# Altium project 2040Macro.PrjPcb
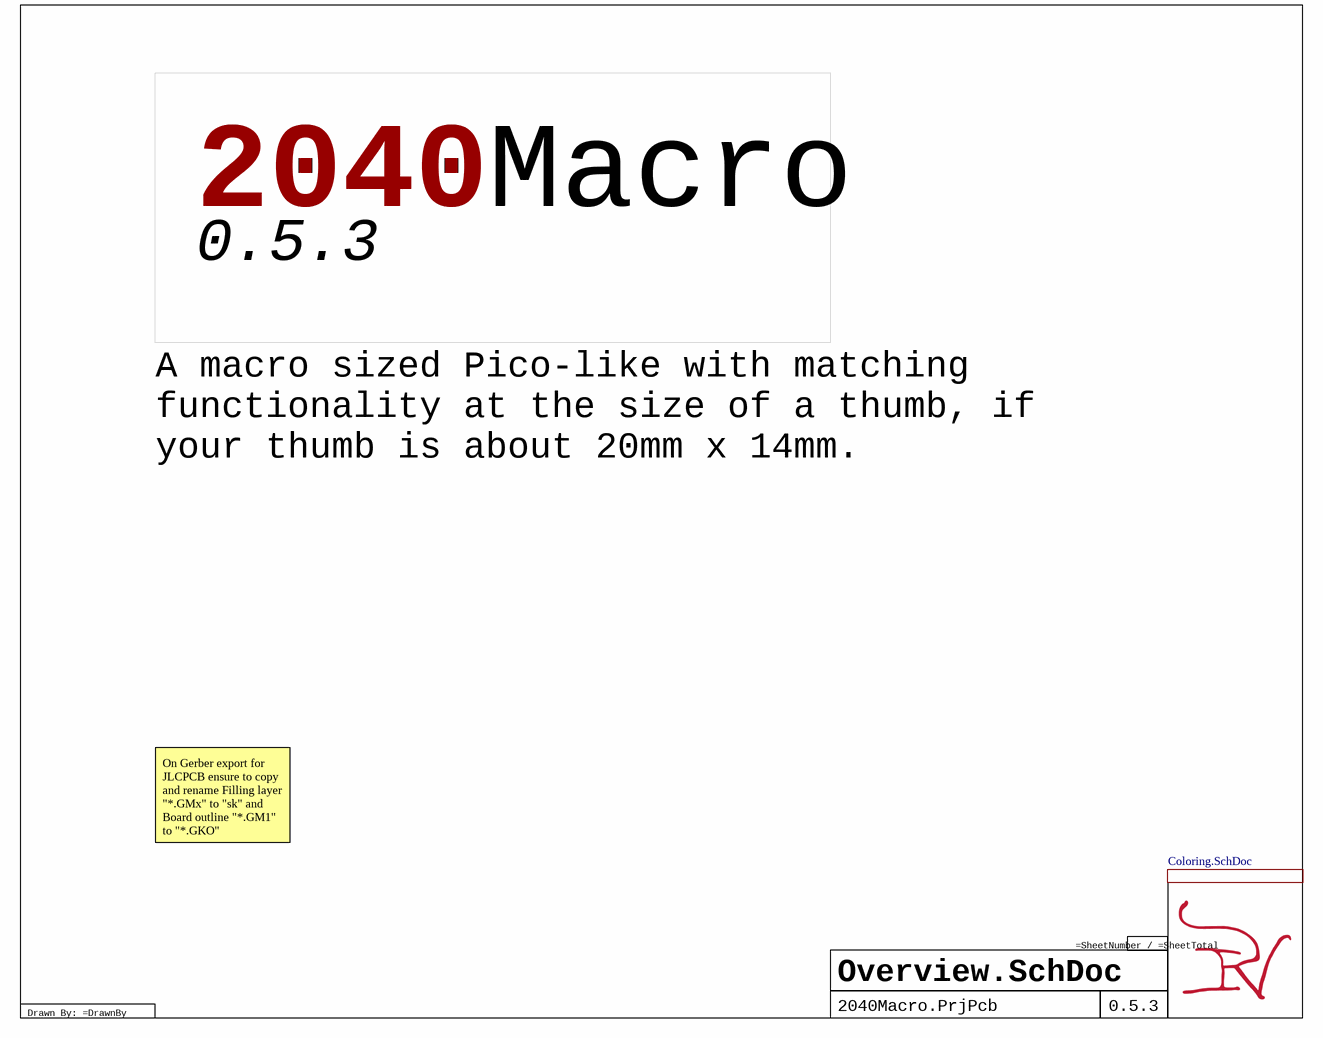
[diagram p0: Overview.SchDoc]
Version: 0.5.3; Project: 2040Macro; LicenceYear: Copyright © 2024; Licence: Licenced under CERN-OHL-P v2; DrawnBy: IR; Author: IR
10 sheets, 56 parts. Net scope: flat (ports and power ports of the same name join across sheets).
Board file: 2040Macro.PcbDoc
Sheets:
  Overview.SchDoc
    LINK_ME_AND_HIDE_DESIGNATOR = 2040Macro-PCB.SchDoc
      U_RP2040 = RP2040.SchDoc
      U_Power = Power.SchDoc
      U_LED = LED.SchDoc
      U_Crystal = Crystal.SchDoc
      U_SPIFlash = SPIFlash.SchDoc
      U_Connectors = Connectors.SchDoc
        U_USBC-DEV-2.0 = USBC-DEV-2.0.SchDoc
    U_Coloring = Coloring.SchDoc

## Sheet Overview.SchDoc: PMPi-PCB
size A; SheetNumber: 1; SheetTotal: 10

### Sub-sheets
LINK_ME_AND_HIDE_DESIGNATOR = 2040Macro-PCB.SchDoc: no entries
U_Coloring = Coloring.SchDoc: no entries

### Notes on the sheet
- 2040
- A macro sized Pico-like with matching functionality at the size of a thumb, if your thumb is about 20mm x 14mm.
- On Gerber export for JLCPCB ensure to copy and rename Filling layer "*.GMx" to "sk" and Board outline "*.GM1" to "*.GKO"
- Drawn By: =DrawnBy

## Sheet 2040Macro-PCB.SchDoc
size A; SheetNumber: 3; SheetTotal: 9
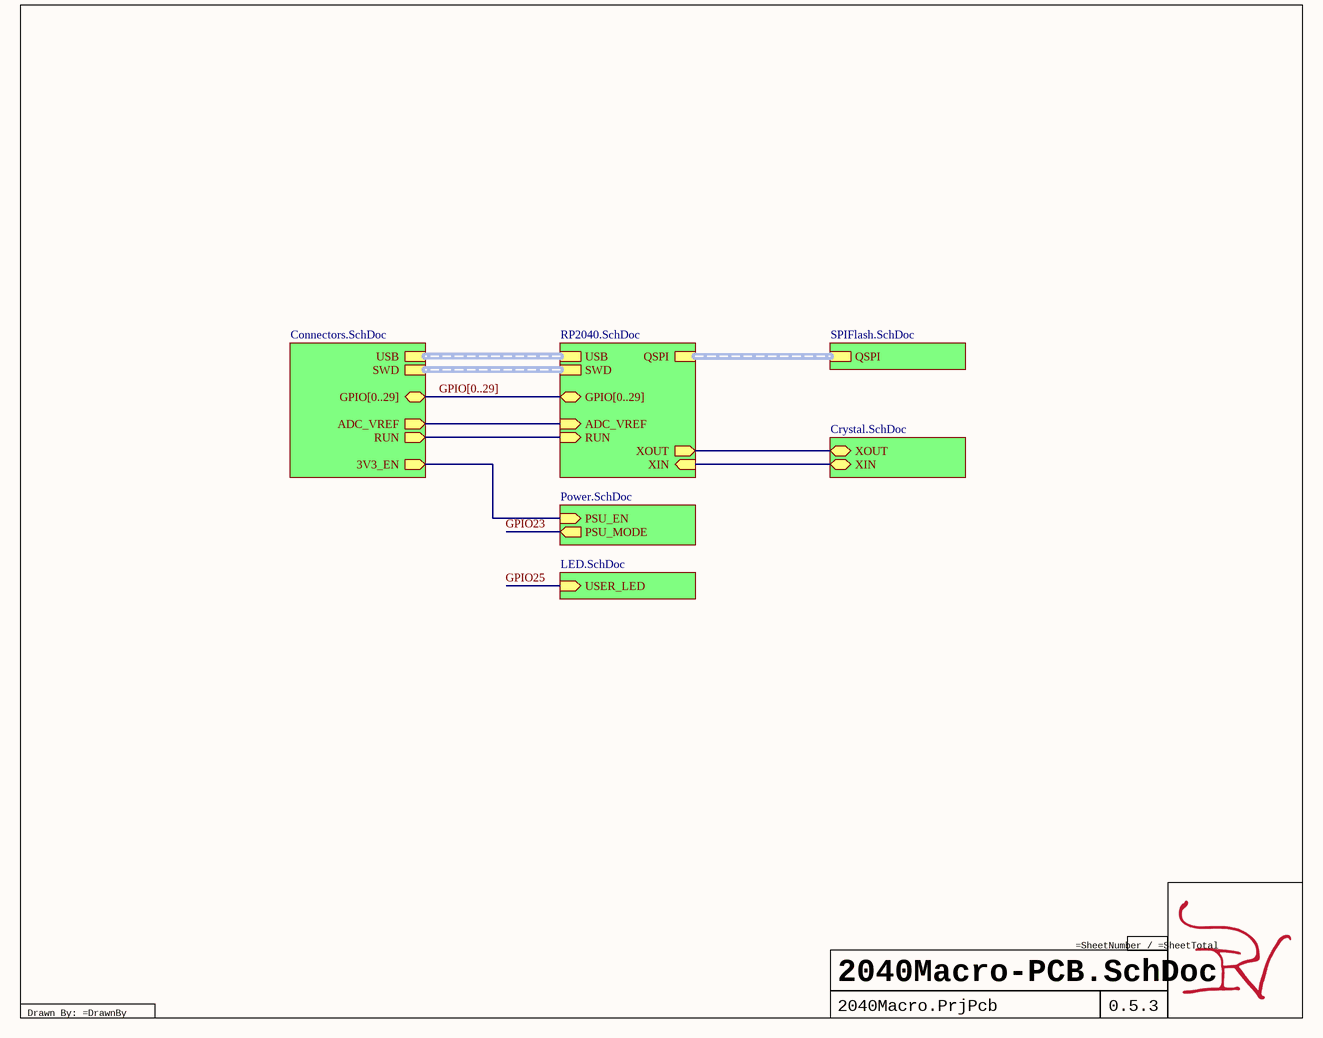
[diagram p1: 2040Macro-PCB.SchDoc]

### Sub-sheets
U_Connectors = Connectors.SchDoc: SWD (harness SWD), USB (harness USB 2.0), GPIO[0..29] (bidir), 3V3_EN (out), ADC_VREF (out), RUN (out)
U_Crystal = Crystal.SchDoc: XIN (bidir), XOUT (bidir)
U_LED = LED.SchDoc: USER_LED (in)
U_Power = Power.SchDoc: PSU_EN (in), PSU_MODE (out)
U_RP2040 = RP2040.SchDoc: GPIO[0..29] (bidir), USB (harness USB 2.0), XIN (in), XOUT (out), SWD (harness SWD), QSPI (harness QSPI), ADC_VREF (in), RUN (in)
U_SPIFlash = SPIFlash.SchDoc: QSPI (harness QSPI)

### Nets
GPIO23: sheet U_Power/PSU_MODE
GPIO25: sheet U_LED/USER_LED
(unnamed): sheet U_RP2040/XIN, sheet U_Crystal/XIN
(unnamed): sheet U_RP2040/XOUT, sheet U_Crystal/XOUT
(unnamed): sheet U_RP2040/ADC_VREF, sheet U_Connectors/ADC_VREF
(unnamed): sheet U_RP2040/RUN, sheet U_Connectors/RUN
(unnamed): sheet U_Power/PSU_EN, sheet U_Connectors/3V3_EN

### Buses and harness runs
bus GPIO[0..29] = sheet U_Connectors/GPIO[0..29] = sheet U_RP2040/GPIO[0..29]
harness sheet U_Connectors/SWD = sheet U_RP2040/SWD
harness sheet U_Connectors/USB = sheet U_RP2040/USB
harness sheet U_RP2040/QSPI = sheet U_SPIFlash/QSPI

### Notes on the sheet
- Drawn By: =DrawnBy

## Sheet RP2040.SchDoc
size A; SheetNumber: 7; SheetTotal: 10
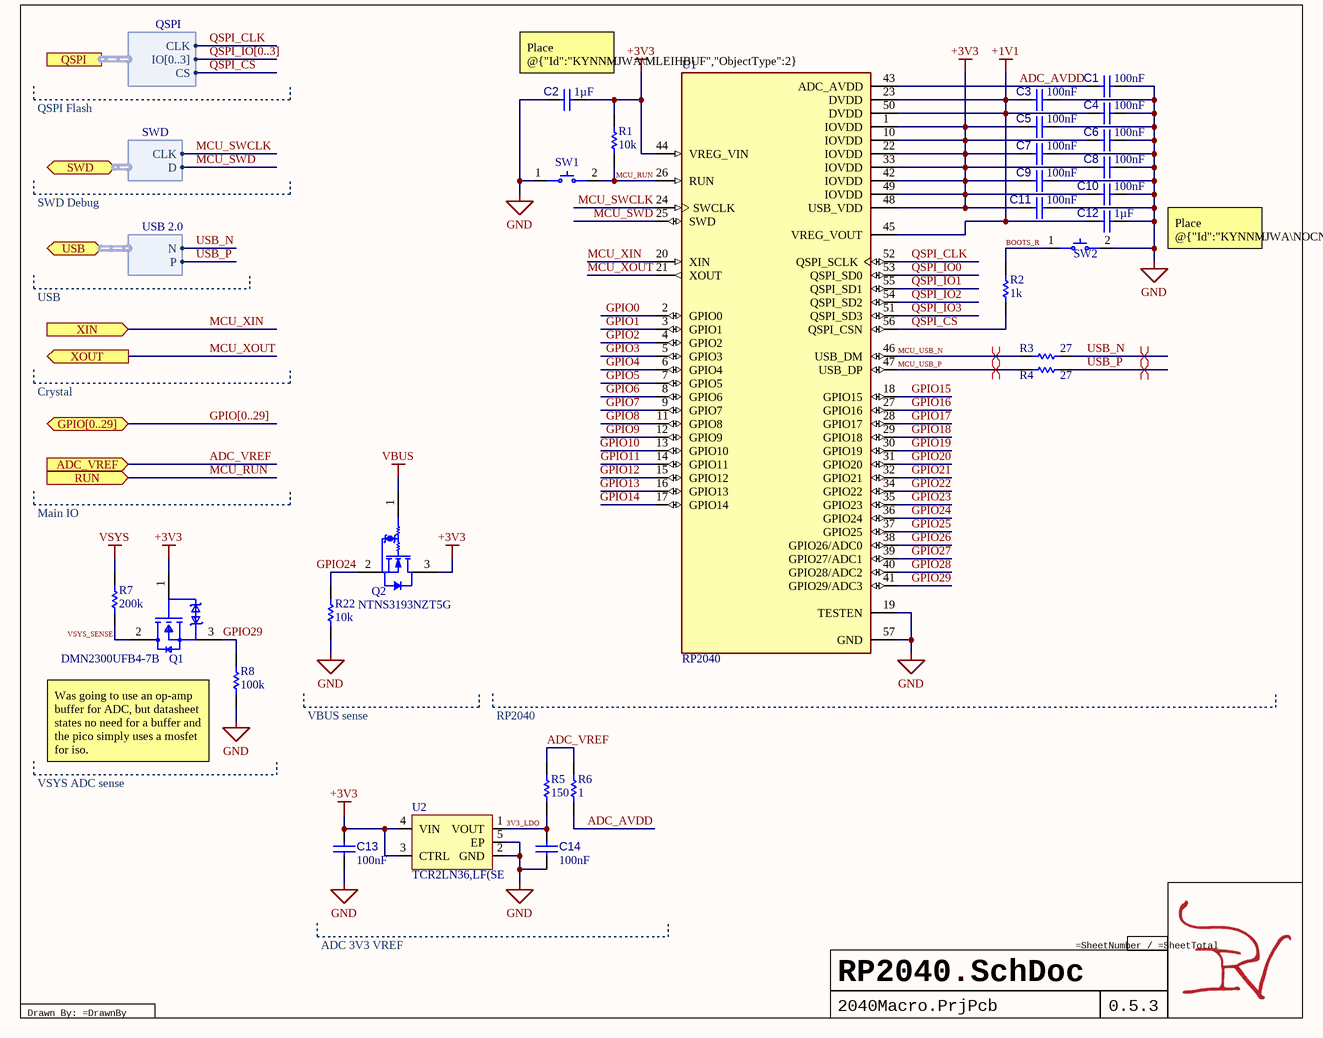
[diagram p2: RP2040.SchDoc]

### Parts
C1  value 100nF  [CAP 0201_0603]  (hidden comment: CL03A104KQ3NNNC)
C2  value 1µF  [CAP 0201_0603]  (hidden comment: GRM033R60J105MEA2D)
C3  value 100nF  [CAP 0201_0603]  (hidden comment: CL03A104KQ3NNNC)
C4  value 100nF  [CAP 0201_0603]  (hidden comment: CL03A104KQ3NNNC)
C5  value 100nF  [CAP 0201_0603]  (hidden comment: CL03A104KQ3NNNC)
C6  value 100nF  [CAP 0201_0603]  (hidden comment: CL03A104KQ3NNNC)
C7  value 100nF  [CAP 0201_0603]  (hidden comment: CL03A104KQ3NNNC)
C8  value 100nF  [CAP 0201_0603]  (hidden comment: CL03A104KQ3NNNC)
C9  value 100nF  [CAP 0201_0603]  (hidden comment: CL03A104KQ3NNNC)
C10  value 100nF  [CAP 0201_0603]  (hidden comment: CL03A104KQ3NNNC)
C11  value 100nF  [CAP 0201_0603]  (hidden comment: CL03A104KQ3NNNC)
C12  value 1µF  [CAP 0201_0603]  (hidden comment: GRM033R60J105MEA2D)
C13  value 100nF  [CAP 0201_0603]  (hidden comment: CL03A104KQ3NNNC)
C14  value 100nF  [CAP 0201_0603]  (hidden comment: CL03A104KQ3NNNC)
Q1  DMN2300UFB4-7B  [FP-X2-DFN1006-3-MFG]
Q2  NTNS3193NZT5G  [ONSC-XLLGA-3-713AB_V]
R1  value 10k  [RES 0201_0603]  (hidden comment: 10k-0201-0.05/1)
R2  value 1k  [RES 0201_0603]
R3  value 27  [RES 0201_0603]  (hidden comment: 27-0201-0.05/1)
R4  value 27  [RES 0201_0603]  (hidden comment: 27-0201-0.05/1)
R5  value 150  [RES 0201_0603]  (hidden comment: 150-0201-0.05/1)
R6  value 1  [RES 0201_0603]  (hidden comment: 1-0201-0.05/1)
R7  value 200k  [RES 0201_0603]  (hidden comment: 200k-0201-0.05/1)
R8  value 100k  [RES 0201_0603]  (hidden comment: 100k-0201-0.05/1)
R22  value 10k  [RES 0201_0603]  (hidden comment: 10k-0201-0.05/1)
SW1  EVP-BB2A9B000  [FP-EVP-BB2A9B000-MFG]  (value not drawn)
SW2  LS38G2F-T  [LS38G2F-T-Footprint-1]  (value not drawn)
U1  RP2040  [QFN40P700X700X90-57N]
U2  TCR2LN36,LF(SE  [SDFN4_TOS]

### Ports
ADC_VREF (in, see 2040Macro-PCB[2B], Connectors[1A]), GPIO[0..29] (bidir, see 2040Macro-PCB[2B], Connectors[1A]), QSPI (harness QSPI, see 2040Macro-PCB[3B], SPIFlash[1A]), RUN (in, see 2040Macro-PCB[2B], Connectors[1A]), SWD (bidir, harness SWD, see 2040Macro-PCB[2B], Connectors[3C]), USB (bidir, harness USB 2.0, see 2040Macro-PCB[2B], Connectors[1A], USBC-DEV-2.0[3B]), XIN (in, see 2040Macro-PCB[3B], Crystal[3B]), XOUT (out, see 2040Macro-PCB[3B], Crystal[3B])

### Harnesses
USB 2.0: N, P
SWD: CLK, D
QSPI: CLK, IO[0..3], CS

### Nets
+1V1: C3.1 C4.1 C12.1 U1.23(DVDD) U1.45(VREG_VOUT) U1.50(DVDD)
+3V3: C2.2 C5.1 C6.1 C7.1 C8.1 C9.1 C10.1 C11.1 C13.2 Q1.1(G) Q2.3(D) R1.2 U1.1(IOVDD) U1.10(IOVDD) U1.22(IOVDD) U1.33(IOVDD) U1.42(IOVDD) U1.44(VREG_VIN) U1.48(USB_VDD) U1.49(IOVDD) U2.3(CTRL) U2.4(VIN)
GND: C1.2 C2.1 C3.2 C4.2 C5.2 C6.2 C7.2 C8.2 C9.2 C10.2 C11.2 C12.2 C13.1 C14.1 R8.1 R22.1 SW1.1 SW2.2 U1.19(TESTEN) U1.57(GND) U2.2(GND) U2.5(EP)
VBUS: Q2.1(G)
VSYS: R7.2
3V3_LDO: C14.2 R5.1 U2.1(VOUT)
ADC_AVDD: C1.1 R6.1 U1.43(ADC_AVDD)
ADC_VREF: R5.2 R6.2 ; port ADC_VREF
BOOTS_R: R2.1 SW2.1
GPIO0: U1.2(GPIO0)
GPIO1: U1.3(GPIO1)
GPIO2: U1.4(GPIO2)
GPIO3: U1.5(GPIO3)
GPIO4: U1.6(GPIO4)
GPIO5: U1.7(GPIO5)
GPIO6: U1.8(GPIO6)
GPIO7: U1.9(GPIO7)
GPIO8: U1.11(GPIO8)
GPIO9: U1.12(GPIO9)
GPIO10: U1.13(GPIO10)
GPIO11: U1.14(GPIO11)
GPIO12: U1.15(GPIO12)
GPIO13: U1.16(GPIO13)
GPIO14: U1.17(GPIO14)
GPIO15: U1.18(GPIO15)
GPIO16: U1.27(GPIO16)
GPIO17: U1.28(GPIO17)
GPIO18: U1.29(GPIO18)
GPIO19: U1.30(GPIO19)
GPIO20: U1.31(GPIO20)
GPIO21: U1.32(GPIO21)
GPIO22: U1.34(GPIO22)
GPIO23: U1.35(GPIO23)
GPIO24: Q2.2(S) R22.2 U1.36(GPIO24)
GPIO25: U1.37(GPIO25)
GPIO26: U1.38(GPIO26/ADC0)
GPIO27: U1.39(GPIO27/ADC1)
GPIO28: U1.40(GPIO28/ADC2)
GPIO29: Q1.3(S) R8.2 U1.41(GPIO29/ADC3)
MCU_RUN: R1.1 SW1.2 U1.26(RUN) ; port RUN
MCU_SWCLK: U1.24(SWCLK) ; port SWD.CLK
MCU_SWD: U1.25(SWD) ; port SWD.D
MCU_USB_N: R3.1 U1.46(USB_DM)
MCU_USB_P: R4.1 U1.47(USB_DP)
MCU_XIN: U1.20(XIN) ; port XIN
MCU_XOUT: U1.21(XOUT) ; port XOUT
QSPI_CLK: U1.52(QSPI_SCLK) ; port QSPI.CLK
QSPI_CS: R2.2 U1.56(QSPI_CSN) ; port QSPI.CS
QSPI_IO0: U1.53(QSPI_SD0)
QSPI_IO1: U1.55(QSPI_SD1)
QSPI_IO2: U1.54(QSPI_SD2)
QSPI_IO3: U1.51(QSPI_SD3)
USB_N: R3.2 ; port USB.N
USB_P: R4.2 ; port USB.P
VSYS_SENSE: Q1.2(D) R7.1

### Buses and harness runs
bus GPIO[0..29] = port GPIO[0..29]
bus QSPI_IO[0..3]

### Layout directives
differential pair: MCU_USB_N, MCU_USB_P, USB_N, USB_P

### Notes on the sheet
- (near C2) Place @{"Id":"KYNNMJWA\MLEIHBUF","ObjectType":2} close to pin 44
- QSPI Flash
- SWD Debug
- USB
- Place @{"Id":"KYNNMJWA\NOCNSBLD","ObjectType":2} close to pin 45
- Crystal
- Main IO
- Was going to use an op-amp buffer for ADC, but datasheet states no need for a buffer and the pico simply uses a mosfet for iso.
- VBUS sense
- RP2040
- VSYS ADC sense
- ADC 3V3 VREF
- Drawn By: =DrawnBy

### Library data of the parts
C1 C3-C11 C13 C14 = CMP-001-00029-1: Ceramic Capacitor, Multilayer, Ceramic, 6.3V, 10% +Tol, 10% -Tol, X5R, 15% TC, 0.1uF, Surface Mount, 0201; Multilayer: Yes; Temperature Characteristics Code: X5R; Capacitor Type: Ceramic; Min Operating Temperature: -55°C; Reach SVHC Compliant: Yes; Termination: Wraparound; Mounting Technology: Surface Mount; Terminal Finish: Nickel; Pins: 2; JESD-609 Code: e3; Rated DC Voltage (URdc): 6.3V; Case/Package: 0201; Packaging: Tape and Reel; Tolerance  (fill in as +-): 10%; Height: 0.3mm; Length: 0.6mm; Package Shape: Rectangular; Max Operating Temperature: 85°C; Package Style: SMTMeter; Tolerance (fill in as +-): 10%; RoHS Compliant: Yes; Dielectric Material: Ceramic; Width: 0.3mm
C2 C12 = CMP-001-00030-2: Ceramic Capacitor, Multilayer, Ceramic, 6.3V, 20% +Tol, 20% -Tol, X5R, 15% TC, 1uF, Surface Mount, 0201; Multilayer: Yes; Reach SVHC Compliant: Yes; Min Operating Temperature: -55°C; Mounting Technology: Surface Mount; Temperature Characteristics Code: X5R; Tolerance (fill in as +-): 20%; Capacitor Type: Ceramic; Pins: 2; Tolerance  (fill in as +-): 20%; RoHS Compliant: Yes; JESD-609 Code: e3; Package Shape: Rectangular; Dielectric Material: Ceramic; Max Operating Temperature: 85°C; Packaging: Tape and Reel; Terminal Finish: Nickel; Rated DC Voltage (URdc): 6.3V; Case/Package: 0201; Termination: Wraparound
Q1 = CMP-013-00001-1: Small Signal Field-Effect Transistor, 1.3A I(D), 20V, 1-Element, N-Channel, Silicon, Metal-oxide Semiconductor FET; Transistor Application: SWITCHING; Qualification Status: Not Qualified; Package Body Material: Plastic; Case Connection: DRAIN; Drain-source On Resistance-Max: 175mR; Time @ Peak Reflow Temperature-Max (s): 40s; Number of Elements: 1; Operating Mode: ENHANCEMENT MODE; Power Dissipation-Max (Abs): 470mW; Package Shape: Rectangular; Package Style: CHIP CARRIERMeter; Transistor Element Material: SILICON; Drain Current-Max (Abs) (ID): 1.3A; Max Operating Temperature: 150°C; FET Technology: METAL-OXIDE SEMICONDUCTOR; Terminal Form: No Lead; Polarity/Channel Type: N-CHANNEL; DS Breakdown Voltage-Min: 20V; RoHS Compliant: Yes; JESD-609 Code: e4; Drain Current-Max (ID): 1.3A; Moisture Sensitivity Level: 1; Reach SVHC Compliant: Yes; Surface Mount: Yes; Terminal Position: BOTTOM; Terminal Finish: Nickel; Peak Reflow Temperature (Cel): 260°C; Pins: 3
Q2 = CMP-013-00002-1: Small Signal Field-Effect Transistor, 0.224A I(D), 1-Element, N-Channel, Metal-oxide Semiconductor FET; Power Dissipation-Max (Abs): 139mW; Drain Current-Max (Abs) (ID): 224mA; RoHS Compliant: Yes; Polarity/Channel Type: N-CHANNEL; Terminal Finish: Nickel; Max Operating Temperature: 150°C; Reach SVHC Compliant: Yes; Surface Mount: Yes; Moisture Sensitivity Level: 1; JESD-609 Code: e4; FET Technology: METAL-OXIDE SEMICONDUCTOR
R1 R22 = CMP-009-00054-1: Fixed Resistor, Metal Glaze/thick Film, 0.05W, 10000ohm, 25V, 1% +/-Tol, 200ppm/Cel, Surface Mount, 0201; Rated Temperature: 70°C; Power: 50mW; Package Height: 0.23mm; Temperature Coefficient: 200ppm/°C; Package Width: 0.3mm; Reference Standard: AEC-Q200; Package Length: 0.6mm; RoHS Compliant: Yes; JESD-609 Code: e3; Resistor Type: FIXED RESISTOR; Termination: Wraparound; Pins: 2; Technology: METAL GLAZE/THICK FILM; Terminal Finish: Nickel; Mounting Technology: Surface Mount; Package Shape: Rectangular; Reach SVHC Compliant: Yes; Package Style: SMTMeter; Case/Package: 0201; Working Voltage: 25V; Packaging: Tape and Reel; Construction: Rectangular; Max Operating Temperature: 125°C; Min Operating Temperature: -55°C; Tolerance: 1%
R2 = CMP-009-00051-1: Fixed Resistor, Metal Glaze/thick Film, 0.05W, 1000ohm, 25V, 1% +/-Tol, 200ppm/Cel, Surface Mount, 0201; Power: 50mW; Package Height: 0.23mm; Package Width: 0.3mm; Reference Standard: AEC-Q200; Package Length: 0.6mm; Rated Temperature: 70°C; Temperature Coefficient: 200ppm/°C; Package Shape: Rectangular; Package Style: SMTMeter; Resistor Type: FIXED RESISTOR; Technology: METAL GLAZE/THICK FILM; Case/Package: 0201; RoHS Compliant: Yes; Termination: Wraparound; Terminal Finish: Nickel; Max Operating Temperature: 125°C; Reach SVHC Compliant: Yes; Packaging: Tape and Reel; Tolerance: 1%; Min Operating Temperature: -55°C; Pins: 2; Working Voltage: 25V; Mounting Technology: Surface Mount; JESD-609 Code: e3; Construction: Rectangular
R3 R4 = CMP-009-00052-2: Fixed Resistor, Metal Glaze/thick Film, 0.05W, 27ohm, 25V, 1% +/-Tol, 200ppm/Cel, Surface Mount, 0201; Temperature Coefficient: 200ppm/°C; Package Width: 0.3mm; Package Length: 0.6mm; Reference Standard: AEC-Q200; Power: 50mW; Package Height: 0.23mm; Rated Temperature: 70°C; Resistor Type: FIXED RESISTOR; Construction: Rectangular; Tolerance: 1%; Pins: 2; Min Operating Temperature: -55°C; Mounting Technology: Surface Mount; Working Voltage: 25V; Case/Package: 0201; Packaging: Tape and Reel; Technology: METAL GLAZE/THICK FILM; Terminal Finish: Nickel; RoHS Compliant: Yes; Package Style: SMTMeter; Termination: Wraparound; Max Operating Temperature: 125°C; Package Shape: Rectangular; JESD-609 Code: e3; Reach SVHC Compliant: Yes
R5 = CMP-009-00059-1: Fixed Resistor, Metal Glaze/thick Film, 0.05W, 150ohm, 25V, 1% +/-Tol, 200ppm/Cel, Surface Mount, 0201; Package Width: 0.3mm; Package Height: 0.23mm; Power: 50mW; Reference Standard: AEC-Q200; Package Length: 0.6mm; Temperature Coefficient: 200ppm/°C; Rated Temperature: 70°C; Reach SVHC Compliant: Yes; Package Shape: Rectangular; Package Style: SMTMeter; Max Operating Temperature: 125°C; RoHS Compliant: Yes; Termination: Wraparound; Min Operating Temperature: -55°C; Tolerance: 1%; Working Voltage: 25V; Technology: METAL GLAZE/THICK FILM; Packaging: Tape and Reel; Mounting Technology: Surface Mount; Pins: 2; Construction: Rectangular; Terminal Finish: Nickel; JESD-609 Code: e3; Resistor Type: FIXED RESISTOR; Case/Package: 0201
R6 = CMP-009-00060-1: Fixed Resistor, Metal Glaze/thick Film, 0.05W, 1ohm, 25V, 1% +/-Tol, -100,350ppm/Cel, Surface Mount, 0201; Package Length: 0.6mm; Reference Standard: AEC-Q200; Rated Temperature: 70°C; Power: 50mW; Temperature Coefficient: 350ppm/°C; Additional Feature: LASER TRIMMABLE; Package Width: 0.3mm; Package Height: 0.23mm; Construction: Chip; Working Voltage: 25V; Terminal Finish: Nickel; Resistor Type: FIXED RESISTOR; Reach SVHC Compliant: Yes; Min Operating Temperature: -55°C; Packaging: Tape and Reel; Tolerance: 1%; Termination: Wraparound; Pins: 2; Case/Package: 0201; Mounting Technology: Surface Mount; Technology: METAL GLAZE/THICK FILM; Package Style: SMTMeter; RoHS Compliant: Yes; Max Operating Temperature: 125°C; JESD-609 Code: e3; Package Shape: Rectangular
R7 = CMP-009-00058-1: Fixed Resistor, Metal Glaze/thick Film, 0.05W, 200000ohm, 25V, 1% +/-Tol, 200ppm/Cel, Surface Mount, 0201; Package Length: 0.6mm; Reference Standard: AEC-Q200; Package Width: 0.3mm; Power: 50mW; Temperature Coefficient: 200ppm/°C; Rated Temperature: 70°C; Package Height: 0.23mm; Termination: Wraparound; Tolerance: 1%; Reach SVHC Compliant: Yes; Mounting Technology: Surface Mount; Pins: 2; Working Voltage: 25V; Construction: Rectangular; Resistor Type: FIXED RESISTOR; RoHS Compliant: Yes; Package Shape: Rectangular; Technology: METAL GLAZE/THICK FILM; Case/Package: 0201; Terminal Finish: Nickel; JESD-609 Code: e3; Min Operating Temperature: -55°C; Packaging: Tape and Reel; Max Operating Temperature: 125°C; Package Style: SMTMeter
R8 = CMP-009-00057-1: Fixed Resistor, Metal Glaze/thick Film, 0.05W, 100000ohm, 25V, 1% +/-Tol, 200ppm/Cel, Surface Mount, 0201; Package Length: 0.6mm; Temperature Coefficient: 200ppm/°C; Package Width: 0.3mm; Rated Temperature: 70°C; Reference Standard: AEC-Q200; Package Height: 0.23mm; Power: 50mW; Resistor Type: FIXED RESISTOR; Package Shape: Rectangular; Mounting Technology: Surface Mount; Max Operating Temperature: 125°C; RoHS Compliant: Yes; Termination: Wraparound; Package Style: SMTMeter; Terminal Finish: Nickel; JESD-609 Code: e3; Reach SVHC Compliant: Yes; Construction: Rectangular; Min Operating Temperature: -55°C; Pins: 2; Packaging: Tape and Reel; Working Voltage: 25V; Tolerance: 1%; Technology: METAL GLAZE/THICK FILM; Case/Package: 0201
SW1 = CMP-011-00001-4: Switch Tactile N.O. SPST Round Button Gull Wing 0.02A 15VDC 1.6N SMD T/R
SW2 = CMP-011-00002-1: Top-press Tactile Switch
U1 = CMP-781-000000-2: Mcu, 32 Bit, 133MHZ, QFN-56;; MF: {'manufacturer': u'Raspberry Pi'}; Availability: Unavailable; MP: RP2040; Source: RP2040.SchLib; Value: *; Design Item ID: RP2040; Price: None; Package: None
U2 = CMP-817-000000-2: LDO Voltage Regulators LDO Reg Vout=3.6V I=200mA; Mfr_Name: Toshiba Electronic Devices & Storage Corp.; Number_devices_in_Package: 1; Design Item ID: TCR2LN36; Source: TCR2LN36.SchLib; Type: Type; RefDes: Refdes; Source_Package: TCR2LN36

## Sheet Power.SchDoc
size A; SheetNumber: 4; SheetTotal: 10
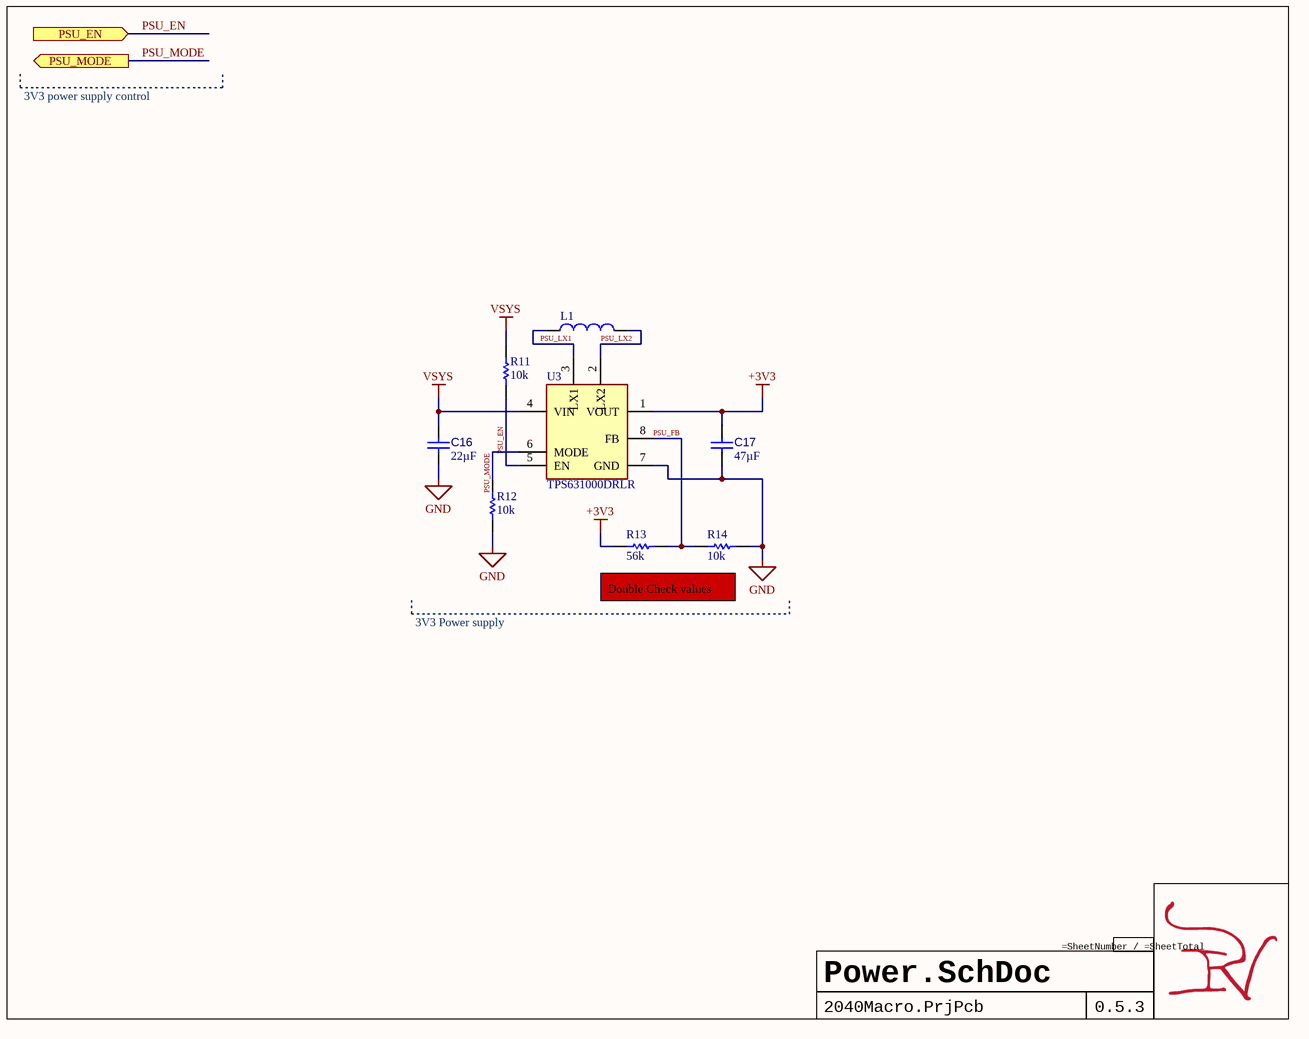
[diagram p3: Power.SchDoc]

### Parts
C16  value 22µF  [CAP 0603_1608]  (hidden comment: CL10A226KQ8NRNE)
C17  value 47µF  [CAP 0805_2012]  (hidden comment: CL21A476MQYNNNE)
L1  CIGT252010EH1R0MNE  [FP-CIGT252010EH1R0MNE-MFG]  (value not drawn)
R11  value 10k  [RES 0201_0603]  (hidden comment: 10k-0201-0.05/1)
R12  value 10k  [RES 0201_0603]  (hidden comment: 10k-0201-0.05/1)
R13  value 56k  [RES 0201_0603]  (hidden comment: 56k-0204-0.05/1)
R14  value 10k  [RES 0201_0603]  (hidden comment: 10k-0201-0.05/1)
U3  TPS631000DRLR  [SOTFL50P160X60-8N]

### Ports
PSU_EN (in, see 2040Macro-PCB[2C]), PSU_MODE (out, see 2040Macro-PCB[2C])

### Nets
+3V3: C17.2 R13.1 U3.1(VOUT)
GND: C16.1 C17.1 R12.2 R14.2 U3.7(GND)
VSYS: C16.2 R11.2 U3.4(VIN)
PSU_EN: R11.1 U3.5(EN) ; port PSU_EN
PSU_FB: R13.2 R14.1 U3.8(FB)
PSU_LX1: L1.1 U3.3(LX1)
PSU_LX2: L1.2 U3.2(LX2)
PSU_MODE: R12.1 U3.6(MODE) ; port PSU_MODE

### Notes on the sheet
- 3V3 power supply control
- 3V3 Power supply
- Double Check values

### Library data of the parts
C16 = CMP-001-00044-1: Ceramic Capacitor, Multilayer, Ceramic, 6.3V, 10% +Tol, 10% -Tol, X5R, 15% TC, 22uF, Surface Mount, 0603; Multilayer: Yes; Case/Package: 0603; Temperature Characteristics Code: X5R; JESD-609 Code: e3; Capacitor Type: Ceramic; Pins: 2; Rated DC Voltage (URdc): 6.3V; Package Style: SMTMeter; Reach SVHC Compliant: Yes; Height: 0.8mm; Tolerance  (fill in as +-): 10%; Terminal Finish: Nickel; Tolerance (fill in as +-): 10%; Max Operating Temperature: 85°C; Mounting Technology: Surface Mount; Dielectric Material: Ceramic; Width: 0.8mm; Length: 1.6mm; Min Operating Temperature: -55°C; Termination: Wraparound; Packaging: Tape and Reel; Package Shape: Rectangular; RoHS Compliant: Yes
C17 = CMP-001-00013-1: Ceramic Capacitor, Multilayer, Ceramic, 6.3V, 20% +Tol, 20% -Tol, X5R, 15% TC, 47uF, Surface Mount, 0805; Mounting Technology: Surface Mount; Max Operating Temperature: 85°C; Pins: 2; RoHS Compliant: Yes; Min Operating Temperature: -55°C; Capacitor Type: Ceramic; Case/Package: 0805
L1 = CMP-006-00002-1: General Purpose Inductor, 1uH, 20%, 1 Element, Metal Composite-Core, SMD; Test Frequency: 1MHz; Shielding: Unshielded; Core Material: Metal,Composite; Shape/Size Description: RECTANGULAR PACKAGE; DC Resistance (DCR): 30mR; Inductor Application: POWER INDUCTOR; Channels: 1; Max Current Rating: 4.1A; Termination: Wraparound; RoHS Compliant: Yes; Terminal Placement: Dual Ended; Surface Mount: Yes; Pins: 2; Max Operating Temperature: 125°C; Reach SVHC Compliant: Yes; Inductance-Nom (L): 1uH; Inductor Type: GENERAL PURPOSE INDUCTOR; Tolerance: 20%; Min Operating Temperature: -40°C
R11 R12 R14 = CMP-009-00054-1: as R1 on sheet RP2040; RoHS Compliant: Yes; JESD-609 Code: e3; Resistor Type: FIXED RESISTOR; Termination: Wraparound; Pins: 2; Technology: METAL GLAZE/THICK FILM; Terminal Finish: Nickel; Mounting Technology: Surface Mount; Package Shape: Rectangular; Reach SVHC Compliant: Yes; Package Style: SMTMeter; Case/Package: 0201; Working Voltage: 25V; Packaging: Tape and Reel; Construction: Rectangular; Max Operating Temperature: 125°C; Min Operating Temperature: -55°C; Tolerance: 1%
R13 = CMP-009-00056-1: Fixed Resistor, Metal Glaze/thick Film, 0.05W, 56000ohm, 25V, 1% +/-Tol, 200ppm/Cel, Surface Mount, 0201; Package Width: 0.3mm; Package Length: 0.6mm; Package Height: 0.23mm; Temperature Coefficient: 200ppm/°C; Reference Standard: AEC-Q200; Rated Temperature: 70°C; Power: 50mW; Resistor Type: FIXED RESISTOR; Construction: Rectangular; RoHS Compliant: Yes; Technology: METAL GLAZE/THICK FILM; Pins: 2; Tolerance: 1%; Termination: Wraparound; Max Operating Temperature: 125°C; Case/Package: 0201; Terminal Finish: Nickel; Min Operating Temperature: -55°C; Package Shape: Rectangular; Packaging: Tape and Reel; Working Voltage: 25V; Package Style: SMTMeter; Reach SVHC Compliant: Yes; JESD-609 Code: e3; Mounting Technology: Surface Mount
U3 = CMP-702-000002-3: 1.5-A output current, high power density buck-boost converter 8-SOT-5X3 -40 to 125; Manufacturer_Name: Texas Instruments; Design Item ID: TPS631000DRLR; Datasheet Link: https://www.ti.com/lit/ds/symlink/tps631000.pdf?ts=1652152702265; Arrow Part Number: TPS631000DRLR; Manufacturer_Part_Number: TPS631000DRLR; Height: 0.6mm; Source: SamacSys.SchLib; Mouser Price/Stock: https://www.mouser.co.uk/ProductDetail/Texas-Instruments/TPS631000DRLR?qs=rSMjJ%252B1ewcRYwoN2deTeNA%3D%3D; Arrow Price/Stock: https://www.arrow.com/en/products/tps631000drlr/texas-instruments?region=nac; Mouser Part Number: 595-TPS631000DRLR

## Sheet LED.SchDoc
size A; SheetNumber: 5; SheetTotal: 10
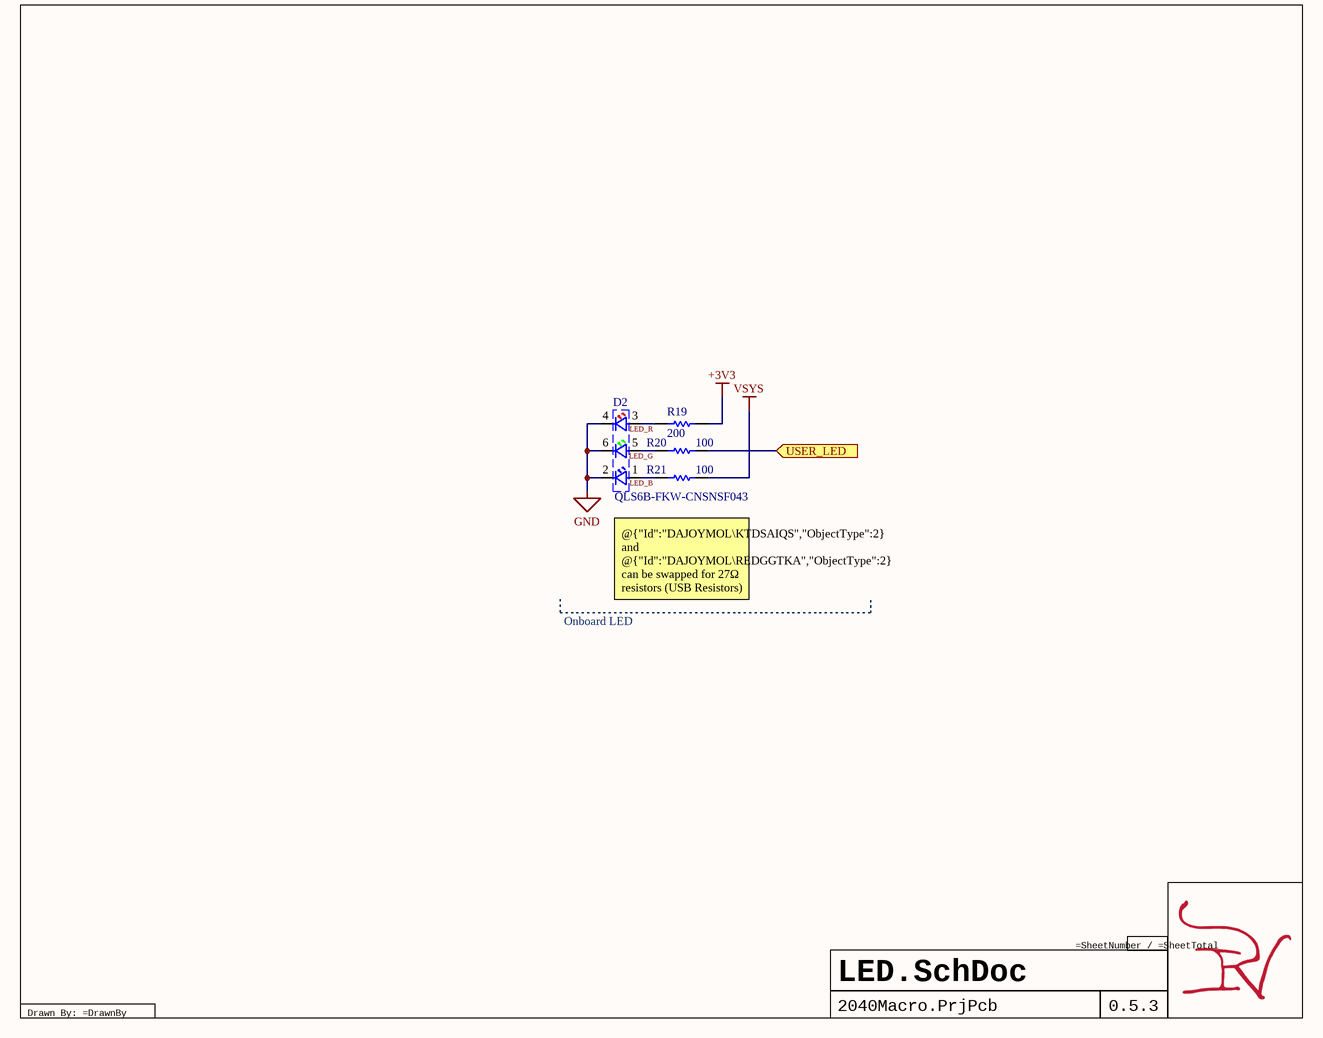
[diagram p4: LED.SchDoc]

### Parts
D2  QLS6B-FKW-CNSNSF043  [LED_QLS6B-FKW-CNSNSF043]
R19  value 200  [RES 0201_0603]  (hidden comment: 200-0201-0.05/1)
R20  value 100  [RES 0201_0603]  (hidden comment: 100-0201-0.05/1)
R21  value 100  [RES 0201_0603]  (hidden comment: 100-0201-0.05/1)

### Ports
USER_LED (in, see 2040Macro-PCB[2C])

### Nets
+3V3: R19.2
GND: D2.2(BLUE_CATHODE) D2.4(RED_CATHODE) D2.6(GREEN_CATHODE)
VSYS: R21.2
LED_B: D2.1(BLUE_ANODE) R21.1
LED_G: D2.5(GREEN_ANODE) R20.1
LED_R: D2.3(RED_ANODE) R19.1
USER_LED: R20.2 ; port USER_LED

### Notes on the sheet
- Onboard LED
- @{"Id":"DAJOYMOL\KTDSAIQS","ObjectType":2} and @{"Id":"DAJOYMOL\REDGGTKA","ObjectType":2} can be swapped for 27Ω resistors (USB Resistors) for ~8mA current if too dim.
- Drawn By: =DrawnBy

### Library data of the parts
D2 = CMP-004-00006-3: Triple Color LED, Red/green/blue; MF: {'manufacturer': u'Cree Inc.'}; Price: None; Design Item ID: QLS6B-FKW-CNSNSF043; MP: QLS6B-FKW-CNSNSF043; Source: QLS6B-FKW-CNSNSF043.SchLib; Value: *; Availability: Unavailable; Case/Package: None
R19 = CMP-009-00055-1: Fixed Resistor, Metal Glaze/thick Film, 0.05W, 200ohm, 25V, 1% +/-Tol, 200ppm/Cel, Surface Mount, 0201; Package Height: 0.23mm; Package Width: 0.3mm; Rated Temperature: 70°C; Power: 50mW; Temperature Coefficient: 200ppm/°C; Package Length: 0.6mm; Reference Standard: AEC-Q200; Package Shape: Rectangular; Reach SVHC Compliant: Yes; Package Style: SMTMeter; Max Operating Temperature: 125°C; Pins: 2; RoHS Compliant: Yes; Termination: Wraparound; Working Voltage: 25V; Terminal Finish: Nickel; Min Operating Temperature: -55°C; Packaging: Tape and Reel; Mounting Technology: Surface Mount; Technology: METAL GLAZE/THICK FILM; Resistor Type: FIXED RESISTOR; JESD-609 Code: e3; Tolerance: 1%; Case/Package: 0201; Construction: Rectangular
R20 R21 = CMP-009-00050-3: Fixed Resistor, Metal Glaze/thick Film, 0.05W, 100ohm, 25V, 1% +/-Tol, 200ppm/Cel, Surface Mount, 0201; Reference Standard: AEC-Q200; Package Height: 0.23mm; Rated Temperature: 70°C; Temperature Coefficient: 200ppm/°C; Package Length: 0.6mm; Power: 50mW; Package Width: 0.3mm; Max Operating Temperature: 125°C; Package Style: SMTMeter; Case/Package: 0201; Reach SVHC Compliant: Yes; JESD-609 Code: e3; Package Shape: Rectangular; Terminal Finish: Nickel; Working Voltage: 25V; Mounting Technology: Surface Mount; Pins: 2; Termination: Wraparound; Construction: Rectangular; Tolerance: 1%; Resistor Type: FIXED RESISTOR; Min Operating Temperature: -55°C; Technology: METAL GLAZE/THICK FILM; RoHS Compliant: Yes; Packaging: Tape and Reel

## Sheet Crystal.SchDoc
size A; SheetNumber: 8; SheetTotal: 10
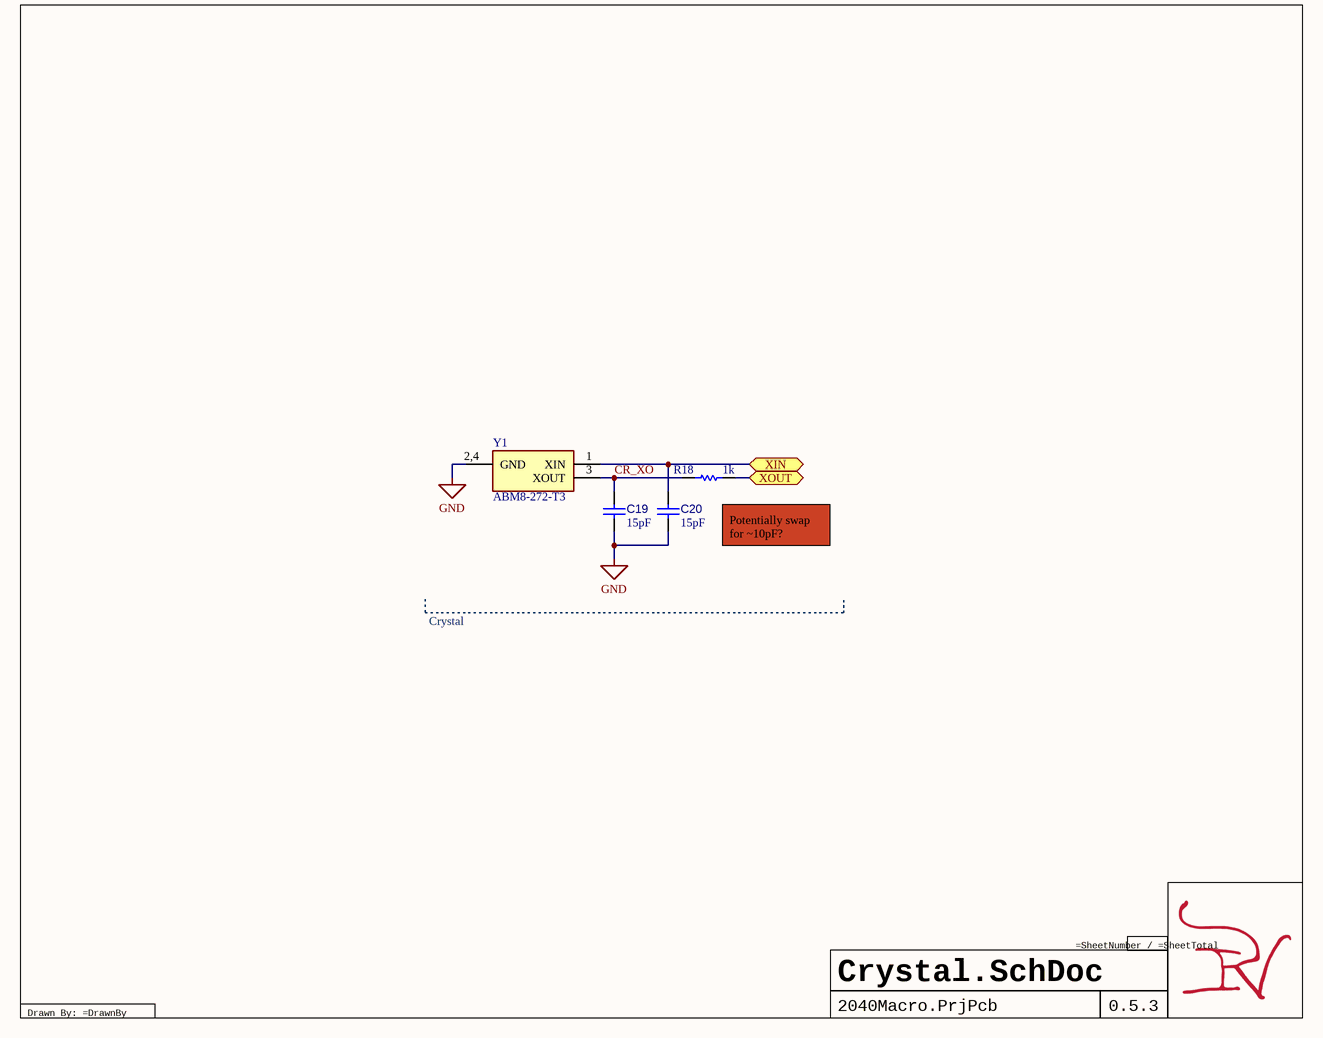
[diagram p5: Crystal.SchDoc]

### Parts
C19  value 15pF  [CAP 0201_0603]  (hidden comment: GRM0335C1H150JA01D)
C20  value 15pF  [CAP 0201_0603]  (hidden comment: GRM0335C1H150JA01D)
R18  value 1k  [RES 0201_0603]  (hidden comment: 1k-0201-0.05/1)
Y1  ABM8-272-T3  [ABM8272T3 - Reduced]

### Ports
XIN (bidir, see 2040Macro-PCB[3B], RP2040[1B]), XOUT (bidir, see 2040Macro-PCB[3B], RP2040[1B])

### Nets
GND: C19.1 C20.1 Y1.2,4(GND)
CR_XO: C19.2 R18.2 Y1.3(XOUT)
MCU_XIN: C20.2 Y1.1(XIN) ; port XIN
MCU_XOUT: R18.1 ; port XOUT

### Notes on the sheet
- (near R18) Potentially swap for ~10pF?
- Crystal
- Drawn By: =DrawnBy

### Library data of the parts
C19 C20 = CMP-001-00040-1: Ceramic Capacitor, Multilayer, Ceramic, 50V, 5% +Tol, 5% -Tol, C0G, 30ppm/Cel TC, 0.000015uF, Surface Mount, 0201; Multilayer: Yes; Tolerance  (fill in as +-): 5%; JESD-609 Code: e3; Mounting Technology: Surface Mount; Reach SVHC Compliant: Yes; Width: 0.3mm; Rated DC Voltage (URdc): 50V; Length: 0.6mm; Termination: Wraparound; Temperature Characteristics Code: C0G; Case/Package: 0201; Pins: 2; Package Shape: Rectangular; Min Operating Temperature: -55°C; Package Style: SMTMeter; Capacitor Type: Ceramic; Terminal Finish: Nickel; Height: 0.3mm; Dielectric Material: Ceramic; Max Operating Temperature: 125°C; RoHS Compliant: Yes; Tolerance (fill in as +-): 5%; Packaging: Tape and Reel
R18 = CMP-009-00051-1: as R2 on sheet RP2040; Package Shape: Rectangular; Package Style: SMTMeter; Resistor Type: FIXED RESISTOR; Technology: METAL GLAZE/THICK FILM; Case/Package: 0201; RoHS Compliant: Yes; Termination: Wraparound; Terminal Finish: Nickel; Max Operating Temperature: 125°C; Reach SVHC Compliant: Yes; Packaging: Tape and Reel; Tolerance: 1%; Min Operating Temperature: -55°C; Pins: 2; Working Voltage: 25V; Mounting Technology: Surface Mount; JESD-609 Code: e3; Construction: Rectangular
Y1 = CMP-003-00000-3: Crystal, 12MHZ, 10PF, 3.2MM X 2.5MM Rohs Compliant: Yes; Manufacturer_Name: ABRACON; Mouser Price/Stock: https://www.mouser.co.uk/ProductDetail/ABRACON/ABM8-272-T3?qs=QpmGXVUTftEj6miOiJBMxQ%3D%3D; Design Item ID: ABM8-272-T3; Mouser Part Number: 815-ABM8-272-T3; Height: 0.8mm; Datasheet Link: https://abracon.com/datasheets/ABM8-272-T3.pdf; Manufacturer_Part_Number: ABM8-272-T3; Source: SamacSys.SchLib

## Sheet SPIFlash.SchDoc
size A; SheetNumber: 6; SheetTotal: 10
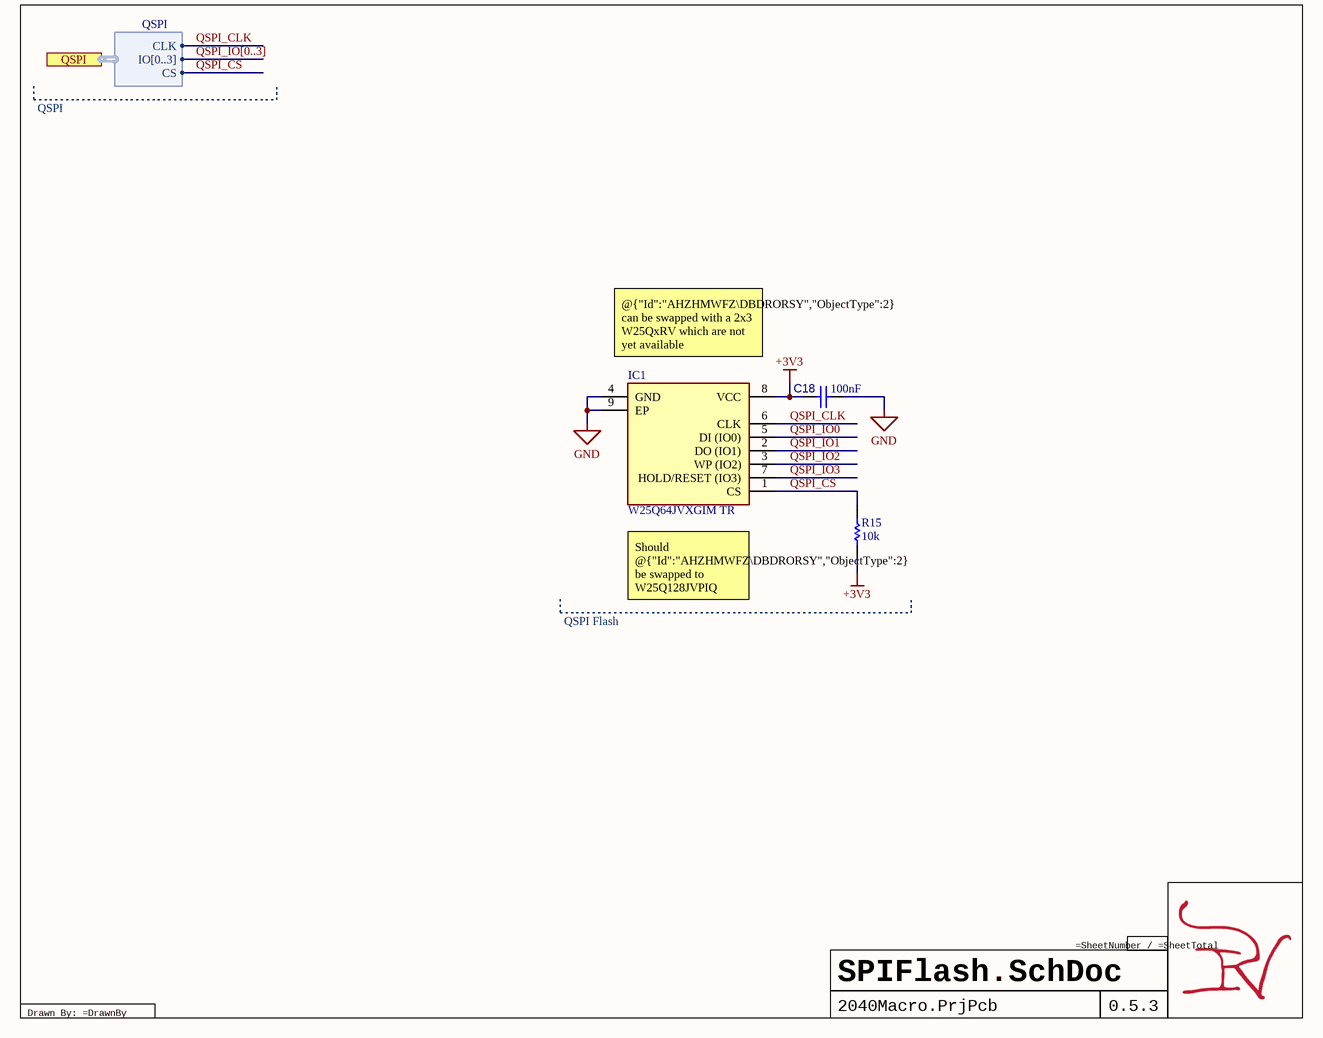
[diagram p6: SPIFlash.SchDoc]

### Parts
C18  value 100nF  [CAP 0201_0603]  (hidden comment: CL03A104KQ3NNNC)
IC1  W25Q64JVXGIM TR  [SON80P400X400X50-9N]
R15  value 10k  [RES 0201_0603]  (hidden comment: 10k-0201-0.05/1)

### Ports
QSPI (harness QSPI, see 2040Macro-PCB[3B], RP2040[1A])

### Harnesses
QSPI: CLK, IO[0..3], CS

### Nets
+3V3: C18.2 IC1.8(VCC) R15.1
GND: C18.1 IC1.4(GND) IC1.9(EP)
QSPI_CLK: IC1.6(CLK) ; port QSPI.CLK
QSPI_CS: IC1.1(CS) R15.2 ; port QSPI.CS
QSPI_IO0: IC1.5(DI_(IO0))
QSPI_IO1: IC1.2(DO_(IO1))
QSPI_IO2: IC1.3(WP_(IO2))
QSPI_IO3: IC1.7(HOLD/RESET_(IO3))

### Buses and harness runs
bus QSPI_IO[0..3]

### Notes on the sheet
- QSPI
- (near IC1) @{"Id":"AHZHMWFZ\DBDRORSY","ObjectType":2} can be swapped with a 2x3 W25QxRV which are not yet available
- QSPI Flash
- (near IC1) Should @{"Id":"AHZHMWFZ\DBDRORSY","ObjectType":2} be swapped to W25Q128JVPIQ instead?
- Drawn By: =DrawnBy

### Library data of the parts
C18 = CMP-001-00029-1: as C1 on sheet RP2040; Temperature Characteristics Code: X5R; Capacitor Type: Ceramic; Min Operating Temperature: -55°C; Reach SVHC Compliant: Yes; Termination: Wraparound; Mounting Technology: Surface Mount; Terminal Finish: Nickel; Pins: 2; JESD-609 Code: e3; Rated DC Voltage (URdc): 6.3V; Case/Package: 0201; Packaging: Tape and Reel; Tolerance  (fill in as +-): 10%; Height: 0.3mm; Length: 0.6mm; Package Shape: Rectangular; Max Operating Temperature: 85°C; Package Style: SMTMeter; Tolerance (fill in as +-): 10%; RoHS Compliant: Yes; Dielectric Material: Ceramic; Width: 0.3mm
IC1 = CMP-031-00008-4: NOR Flash Serial (SPI, Dual SPI, Quad SPI) 3V/3.3V 64M-bit 8M x 8 6ns 8-Pin XSON EP Tube; Manufacturer_Name: Winbond; Height: 0.5mm; Mouser Part Number: 454-W25Q64JVXGIMTR; Design Item ID: W25Q64JVXGIM_TR; Arrow Part Number: W25Q64JVXGIM TR; Datasheet Link: https://www.winbond.com/resource-files/w25q64jv_dtr%20revj%2003272018%20plus.pdf; Source: SamacSys.SchLib; Manufacturer_Part_Number: W25Q64JVXGIM TR; Arrow Price/Stock: https://www.arrow.com/en/products/w25q64jvxgim-tr/winbond-electronics?region=nac; Mouser Price/Stock: https://www.mouser.co.uk/ProductDetail/Winbond/W25Q64JVXGIM-TR?qs=qSfuJ%252Bfl%2Fd5DYf7S8uijYQ%3D%3D
R15 = CMP-009-00054-1: as R1 on sheet RP2040; RoHS Compliant: Yes; JESD-609 Code: e3; Resistor Type: FIXED RESISTOR; Termination: Wraparound; Pins: 2; Technology: METAL GLAZE/THICK FILM; Terminal Finish: Nickel; Mounting Technology: Surface Mount; Package Shape: Rectangular; Reach SVHC Compliant: Yes; Package Style: SMTMeter; Case/Package: 0201; Working Voltage: 25V; Packaging: Tape and Reel; Construction: Rectangular; Max Operating Temperature: 125°C; Min Operating Temperature: -55°C; Tolerance: 1%

## Sheet Connectors.SchDoc
size A; SheetNumber: 9; SheetTotal: 10
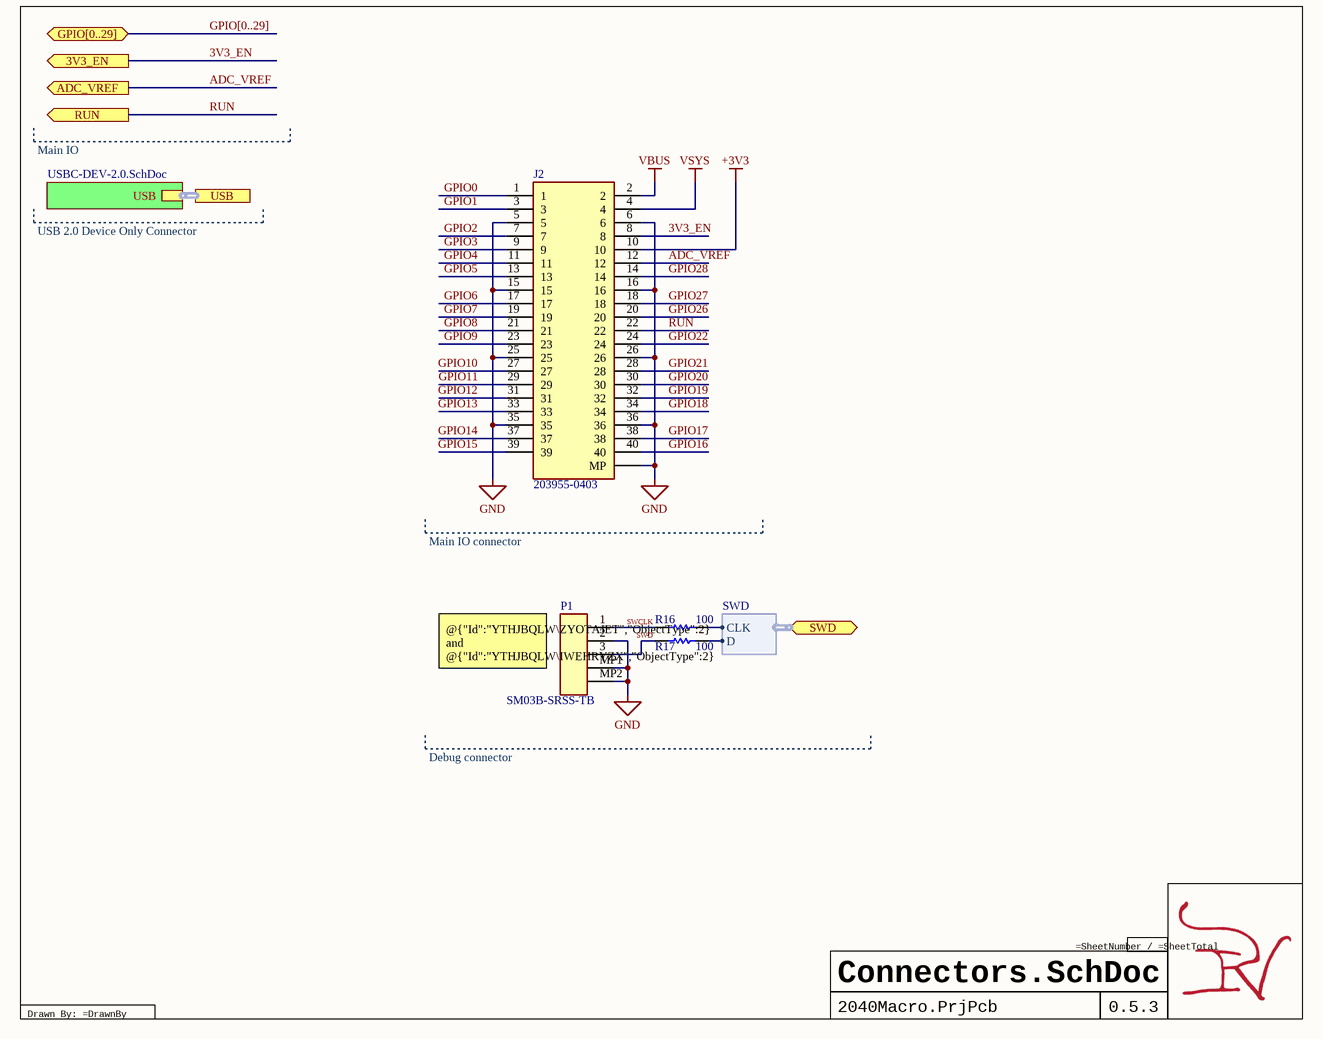
[diagram p7: Connectors.SchDoc]

### Parts
J2  203955-0403  [2039550403]
P1  SM03B-SRSS-TB  [JST-SM03B-SRSS-TB_V]
R16  value 100  [RES 0201_0603]  (hidden comment: 100-0201-0.05/1)
R17  value 100  [RES 0201_0603]  (hidden comment: 100-0201-0.05/1)

### Sub-sheets
U_USBC-DEV-2.0 = USBC-DEV-2.0.SchDoc: USB (harness USB 2.0)

### Ports
3V3_EN (out, see 2040Macro-PCB[2B]), ADC_VREF (out, see 2040Macro-PCB[2B], RP2040[1B]), GPIO[0..29] (bidir, see 2040Macro-PCB[2B], RP2040[1B]), RUN (out, see 2040Macro-PCB[2B], RP2040[1B]), SWD (bidir, harness SWD, see 2040Macro-PCB[2B], RP2040[1A]), USB (harness USB 2.0, see 2040Macro-PCB[2B], RP2040[1A], USBC-DEV-2.0[3B])

### Harnesses
SWD: CLK, D

### Nets
+3V3: J2.10
GND: J2.5 J2.6 J2.15 J2.16 J2.25 J2.26 J2.35 J2.36 J2.MP1,_MP2,_MP3,_MP4(MP) P1.2 P1.MP1 P1.MP2
VBUS: J2.2
VSYS: J2.4
3V3_EN: J2.8 ; port 3V3_EN
ADC_VREF: J2.12 ; port ADC_VREF
GPIO0: J2.1
GPIO1: J2.3
GPIO2: J2.7
GPIO3: J2.9
GPIO4: J2.11
GPIO5: J2.13
GPIO6: J2.17
GPIO7: J2.19
GPIO8: J2.21
GPIO9: J2.23
GPIO10: J2.27
GPIO11: J2.29
GPIO12: J2.31
GPIO13: J2.33
GPIO14: J2.37
GPIO15: J2.39
GPIO16: J2.40
GPIO17: J2.38
GPIO18: J2.34
GPIO19: J2.32
GPIO20: J2.30
GPIO21: J2.28
GPIO22: J2.24
GPIO26: J2.20
GPIO27: J2.18
GPIO28: J2.14
MCU_SWCLK: R16.2 ; port SWD.CLK
MCU_SWD: R17.2 ; port SWD.D
RUN: J2.22 ; port RUN  [project net MCU_RUN]
SWCLK: P1.1 R16.1
SWD: P1.3 R17.1

### Buses and harness runs
bus GPIO[0..29] = port GPIO[0..29]
harness port USB = sheet U_USBC-DEV-2.0/USB

### Notes on the sheet
- Main IO
- USB 2.0 Device Only Connector
- Main IO connector
- (near P1) @{"Id":"YTHJBQLW\ZYOTAJET","ObjectType":2} and @{"Id":"YTHJBQLW\IWEHRYZX","ObjectType":2} must be placed very close RP2040
- Debug connector
- Drawn By: =DrawnBy

### Library data of the parts
J2 = CMP-702-000003-3: SlimStack Board-to-Board Receptacle, 0.40mm Pitch, FSB5 Floating Series, 5.00mm Mated Height, 3.80mm Mated Width, 40...; Manufacturer_Name: Molex; Mouser Price/Stock: https://www.mouser.co.uk/ProductDetail/Molex/203955-0403?qs=GBLSl2Akirtl%2FPuTWbQ1%252BQ%3D%3D; Height: 3.1mm; Design Item ID: 203955-0403; Mouser Part Number: 538-203955-0403; Manufacturer_Part_Number: 203955-0403; Datasheet Link: https://www.molex.com/pdm_docs/sd/2039550403_sd.pdf; Source: SamacSys.SchLib
P1 = CMP-002-00021-1: CONN HEADER SH 3POS SIDE 1MM TIN
R16 R17 = CMP-009-00050-3: Fixed Resistor, Metal Glaze/thick Film, 0.05W, 100ohm, 25V, 1% +/-Tol, 200ppm/Cel, Surface Mount, 0201; Power: 50mW; Package Height: 0.23mm; Package Length: 0.6mm; Package Width: 0.3mm; Rated Temperature: 70°C; Reference Standard: AEC-Q200; Temperature Coefficient: 200ppm/°C; RoHS Compliant: Yes; Max Operating Temperature: 125°C; Min Operating Temperature: -55°C; Case/Package: 0201; Tolerance: 1%; Mounting Technology: Surface Mount; Pins: 2; Construction: Rectangular; JESD-609 Code: e3; Package Shape: Rectangular; Package Style: SMTMeter; Packaging: Tape and Reel; Reach SVHC Compliant: Yes; Resistor Type: FIXED RESISTOR; Technology: METAL GLAZE/THICK FILM; Terminal Finish: Nickel; Termination: Wraparound; Working Voltage: 25V

## Sheet USBC-DEV-2.0.SchDoc
size A; SheetNumber: 10; SheetTotal: 9
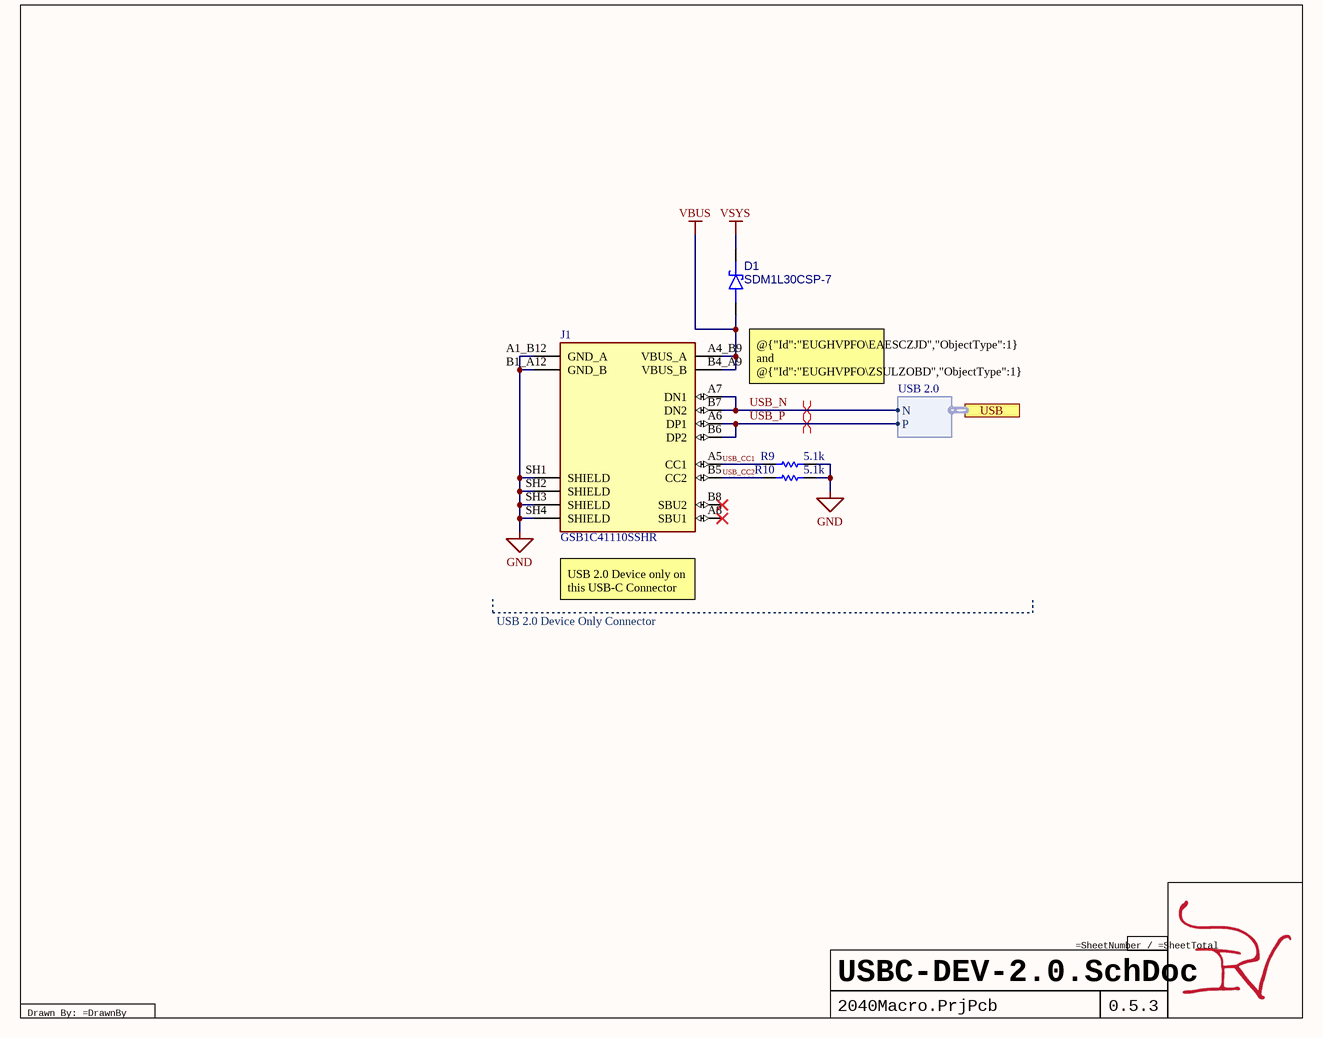
[diagram p8: USBC-DEV-2.0.SchDoc]

### Parts
D1  SDM1L30CSP-7  [SDM1L30CSP-7-Footprint-1]
J1  GSB1C41110SSHR  [AMPHENOL_GSB1C41110SSHR]
R9  value 5.1k  [RES 0201_0603]  (hidden comment: 5k1-0201-0.05/1)
R10  value 5.1k  [RES 0201_0603]  (hidden comment: 5k1-0201-0.05/1)

### Ports
USB (harness USB 2.0, see Connectors[2C], RP2040[1B])

### Harnesses
USB 2.0: N, P

### Nets
GND: J1.A1_B12(GND_A) J1.B1_A12(GND_B) J1.SH1(SHIELD) J1.SH2(SHIELD) J1.SH3(SHIELD) J1.SH4(SHIELD) R9.2 R10.2
VBUS: D1.2(A) J1.A4_B9(VBUS_A) J1.B4_A9(VBUS_B)
VSYS: D1.1(K)
USB_CC1: J1.A5(CC1) R9.1
USB_CC2: J1.B5(CC2) R10.1
USB_N: J1.A7(DN1) J1.B7(DN2) ; port USB.N
USB_P: J1.A6(DP1) J1.B6(DP2) ; port USB.P

Not connected (* = marked no-connect by the designer): J1 A8(SBU1)* B8(SBU2)*

### Layout directives
differential pair: USB_N, USB_P

### Notes on the sheet
- (near D1) @{"Id":"EUGHVPFO\EAESCZJD","ObjectType":1} and @{"Id":"EUGHVPFO\ZSULZOBD","ObjectType":1} pull-up resistors are handled by RP2040
- USB 2.0 Device Only Connector
- (near J1) USB 2.0 Device only on this USB-C Connector
- Drawn By: =DrawnBy

### Library data of the parts
D1 = CMP-004-00005-2: Rectifier Diode, Schottky, 1 Phase, 1 Element, 1A, 30V V(RRM), Silicon; Package Body Material: Plastic; Number of Elements: 1; Terminal Finish: Copper; Min Operating Temperature: -55°C; Reach SVHC Compliant: Yes; Diode Type: RECTIFIER; Moisture Sensitivity Level: 1; Max Output current: 1A; Surface Mount: Yes; RoHS Compliant: Yes; Package Shape: Rectangular; Pins: 2; Terminal Position: BOTTOM; Rep Pk Reverse Voltage-Max: 30V; Max Operating Temperature: 150°C; Package Style: CHIP CARRIERMeter; JESD-609 Code: e2; Technology: SCHOTTKY; Terminal Form: No Lead; Diode Element Material: SILICON
J1 = CMP-786-000000-3: USB2.0, Type C, Top Mount, Center Height 1.63MM, Single Row SMT; MF: {'manufacturer': u'Amphenol Canada'}; Package: None; Value: *; Design Item ID: GSB1C41110SSHR; Availability: Unavailable; MP: GSB1C41110SSHR; Source: GSB1C41110SSHR.SchLib; Price: None
R9 R10 = CMP-009-00053-1: Fixed Resistor, Metal Glaze/thick Film, 0.05W, 5100ohm, 25V, 1% +/-Tol, 200ppm/Cel, Surface Mount, 0201; Power: 50mW; Reference Standard: AEC-Q200; Temperature Coefficient: 200ppm/°C; Package Width: 0.3mm; Rated Temperature: 70°C; Package Height: 0.23mm; Package Length: 0.6mm; Min Operating Temperature: -55°C; Max Operating Temperature: 125°C; Tolerance: 1%; Pins: 2; Case/Package: 0201; Construction: Rectangular; Packaging: Tape and Reel; JESD-609 Code: e3; Terminal Finish: Nickel; Termination: Wraparound; Package Style: SMTMeter; Working Voltage: 25V; Package Shape: Rectangular; Resistor Type: FIXED RESISTOR; RoHS Compliant: Yes; Reach SVHC Compliant: Yes; Mounting Technology: Surface Mount; Technology: METAL GLAZE/THICK FILM

## Sheet Coloring.SchDoc
size 88 x 127 mm; SheetNumber: 10; SheetTotal: 10
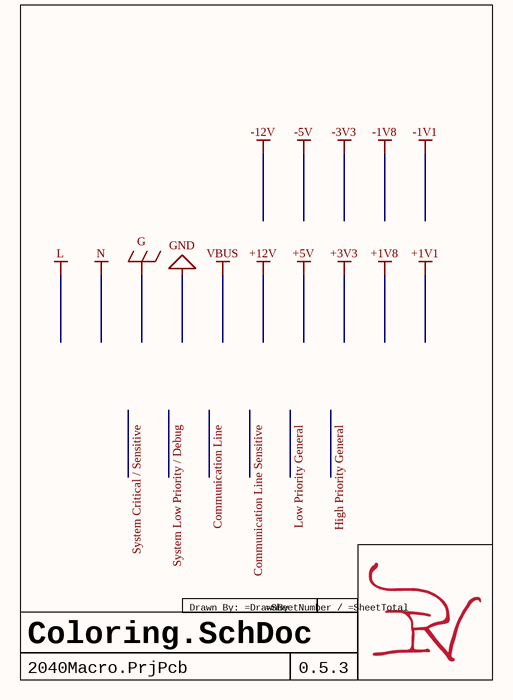
[diagram p9: Coloring.SchDoc]

### Notes on the sheet
- Drawn By: =DrawnBy

## Nets that join several sheets
+3V3: RP2040 (22 pins), Power (C17.2 R13.1 U3.1), LED (R19.2), SPIFlash (C18.2 IC1.8 R15.1), Connectors (J2.10)
GND: RP2040 (22 pins), Power (5 pins), LED (D2.2 D2.4 D2.6), Crystal (C19.1 C20.1 Y1.2,4), SPIFlash (C18.1 IC1.4 IC1.9), Connectors (12 pins), USBC-DEV-2.0 (8 pins)
VBUS: RP2040 (Q2.1), Connectors (J2.2), USBC-DEV-2.0 (D1.2 J1.A4_B9 J1.B4_A9)
VSYS: RP2040 (R7.2), Power (C16.2 R11.2 U3.4), LED (R21.2), Connectors (J2.4), USBC-DEV-2.0 (D1.1)
ADC_VREF: RP2040 (R5.2 R6.2), Connectors (J2.12)
GPIO0: RP2040 (U1.2), Connectors (J2.1)
GPIO1: RP2040 (U1.3), Connectors (J2.3)
GPIO2: RP2040 (U1.4), Connectors (J2.7)
GPIO3: RP2040 (U1.5), Connectors (J2.9)
GPIO4: RP2040 (U1.6), Connectors (J2.11)
GPIO5: RP2040 (U1.7), Connectors (J2.13)
GPIO6: RP2040 (U1.8), Connectors (J2.17)
GPIO7: RP2040 (U1.9), Connectors (J2.19)
GPIO8: RP2040 (U1.11), Connectors (J2.21)
GPIO9: RP2040 (U1.12), Connectors (J2.23)
GPIO10: RP2040 (U1.13), Connectors (J2.27)
GPIO11: RP2040 (U1.14), Connectors (J2.29)
GPIO12: RP2040 (U1.15), Connectors (J2.31)
GPIO13: RP2040 (U1.16), Connectors (J2.33)
GPIO14: RP2040 (U1.17), Connectors (J2.37)
GPIO15: RP2040 (U1.18), Connectors (J2.39)
GPIO16: RP2040 (U1.27), Connectors (J2.40)
GPIO17: RP2040 (U1.28), Connectors (J2.38)
GPIO18: RP2040 (U1.29), Connectors (J2.34)
GPIO19: RP2040 (U1.30), Connectors (J2.32)
GPIO20: RP2040 (U1.31), Connectors (J2.30)
GPIO21: RP2040 (U1.32), Connectors (J2.28)
GPIO22: RP2040 (U1.34), Connectors (J2.24)
GPIO26: RP2040 (U1.38), Connectors (J2.20)
GPIO27: RP2040 (U1.39), Connectors (J2.18)
GPIO28: RP2040 (U1.40), Connectors (J2.14)
MCU_RUN: RP2040 (R1.1 SW1.2 U1.26), Connectors (J2.22)
MCU_SWCLK: RP2040 (U1.24), Connectors (R16.2)
MCU_SWD: RP2040 (U1.25), Connectors (R17.2)
MCU_XIN: RP2040 (U1.20), Crystal (C20.2 Y1.1)
MCU_XOUT: RP2040 (U1.21), Crystal (R18.1)
QSPI_CLK: RP2040 (U1.52), SPIFlash (IC1.6)
QSPI_CS: RP2040 (R2.2 U1.56), SPIFlash (IC1.1 R15.2)
QSPI_IO0: RP2040 (U1.53), SPIFlash (IC1.5)
QSPI_IO1: RP2040 (U1.55), SPIFlash (IC1.2)
QSPI_IO2: RP2040 (U1.54), SPIFlash (IC1.3)
QSPI_IO3: RP2040 (U1.51), SPIFlash (IC1.7)
USB_N: RP2040 (R3.2), USBC-DEV-2.0 (J1.A7 J1.B7)
USB_P: RP2040 (R4.2), USBC-DEV-2.0 (J1.A6 J1.B6)